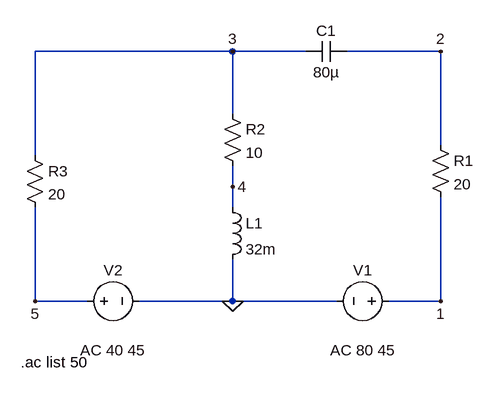
[diagram p0: schematic ex3.asc]
ex3.asc, the LTspice schematic file:
Version 4
SHEET 1 880 680
WIRE -32 0 -336 0
WIRE 80 0 -32 0
WIRE 288 0 144 0
WIRE -32 96 -32 0
WIRE 288 144 288 0
WIRE -336 160 -336 0
WIRE -32 208 -32 176
WIRE -32 240 -32 208
WIRE -336 384 -336 240
WIRE -256 384 -336 384
WIRE -32 384 -32 320
WIRE -32 384 -176 384
WIRE 128 384 -32 384
WIRE 288 384 288 224
WIRE 288 384 208 384
FLAG -32 384 0
FLAG 288 384 1
FLAG 288 0 2
FLAG -32 0 3
FLAG -32 208 4
FLAG -336 384 5
SYMBOL cap 144 -16 R90
WINDOW 0 0 32 VBottom 2
WINDOW 3 32 32 VTop 2
SYMATTR InstName C1
SYMATTR Value 80µ
SYMBOL res 272 128 R0
SYMATTR InstName R1
SYMATTR Value 20
SYMBOL res -48 80 R0
SYMATTR InstName R2
SYMATTR Value 10
SYMBOL ind -48 224 R0
SYMATTR InstName L1
SYMATTR Value 32m
SYMBOL res -352 144 R0
SYMATTR InstName R3
SYMATTR Value 20
SYMBOL voltage 224 384 R90
WINDOW 0 -32 56 VBottom 2
WINDOW 3 32 56 VTop 2
WINDOW 123 60 56 VTop 2
WINDOW 39 0 0 Left 0
SYMATTR InstName V1
SYMATTR Value ""
SYMATTR Value2 AC 80 45
SYMBOL voltage -272 384 R270
WINDOW 0 32 56 VTop 2
WINDOW 3 -32 56 VBottom 2
WINDOW 123 -60 56 VBottom 2
WINDOW 39 0 0 Left 0
SYMATTR InstName V2
SYMATTR Value ""
SYMATTR Value2 AC 40 45
TEXT -358 478 Left 2 !.ac list 50

The netlist it stands for:
* ex3.asc
C1 2 3 80µ
R1 2 1 20
R2 3 4 10
L1 4 0 32m
R3 3 5 20
V1 1 0 AC 80 45
V2 5 0 AC 40 45
.ac list 50
.backanno
.end

* Results of the author's LTspice run, read from the files saved beside the schematic
* AC Analysis:
*   frequency = 50 
*   V(2) = 56.46 V
*   V(3) = -4.247 mV
*   V(1) = 56.57 V
*   V(4) = -14.2 V
*   V(5) = 28.28 V
*   I(C1) = 5.496 mA
*   I(L1) = 1.42 A
*   I(R3) = -1.414 A
*   I(R2) = 1.42 A
*   I(R1) = -5.496 mA
*   I(V2) = -1.414 A
*   I(V1) = -5.496 mA